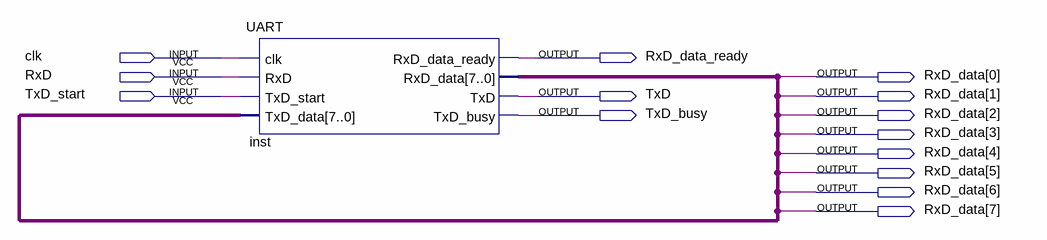
[diagram p0: schematic sheet]
// Quartus schematic UART_Test.bdf as structural Verilog: 1 symbols, 14 pins
module UART_Test (
  input  clk,
  input  RxD,
  input  TxD_start,
  output RxD_data_ready,
  output [7:0] RxD_data,
  output TxD,
  output TxD_busy
);

  wire [7:0] inst_rxd_data;

  UART inst (
    .clk(clk), .RxD(RxD), .TxD_start(TxD_start), .TxD_data(inst_rxd_data), .RxD_data_ready(RxD_data_ready),
    .RxD_data(inst_rxd_data), .TxD(TxD), .TxD_busy(TxD_busy));
endmodule
